# EAGLE schematic LED (EAGLE 9.5.1)
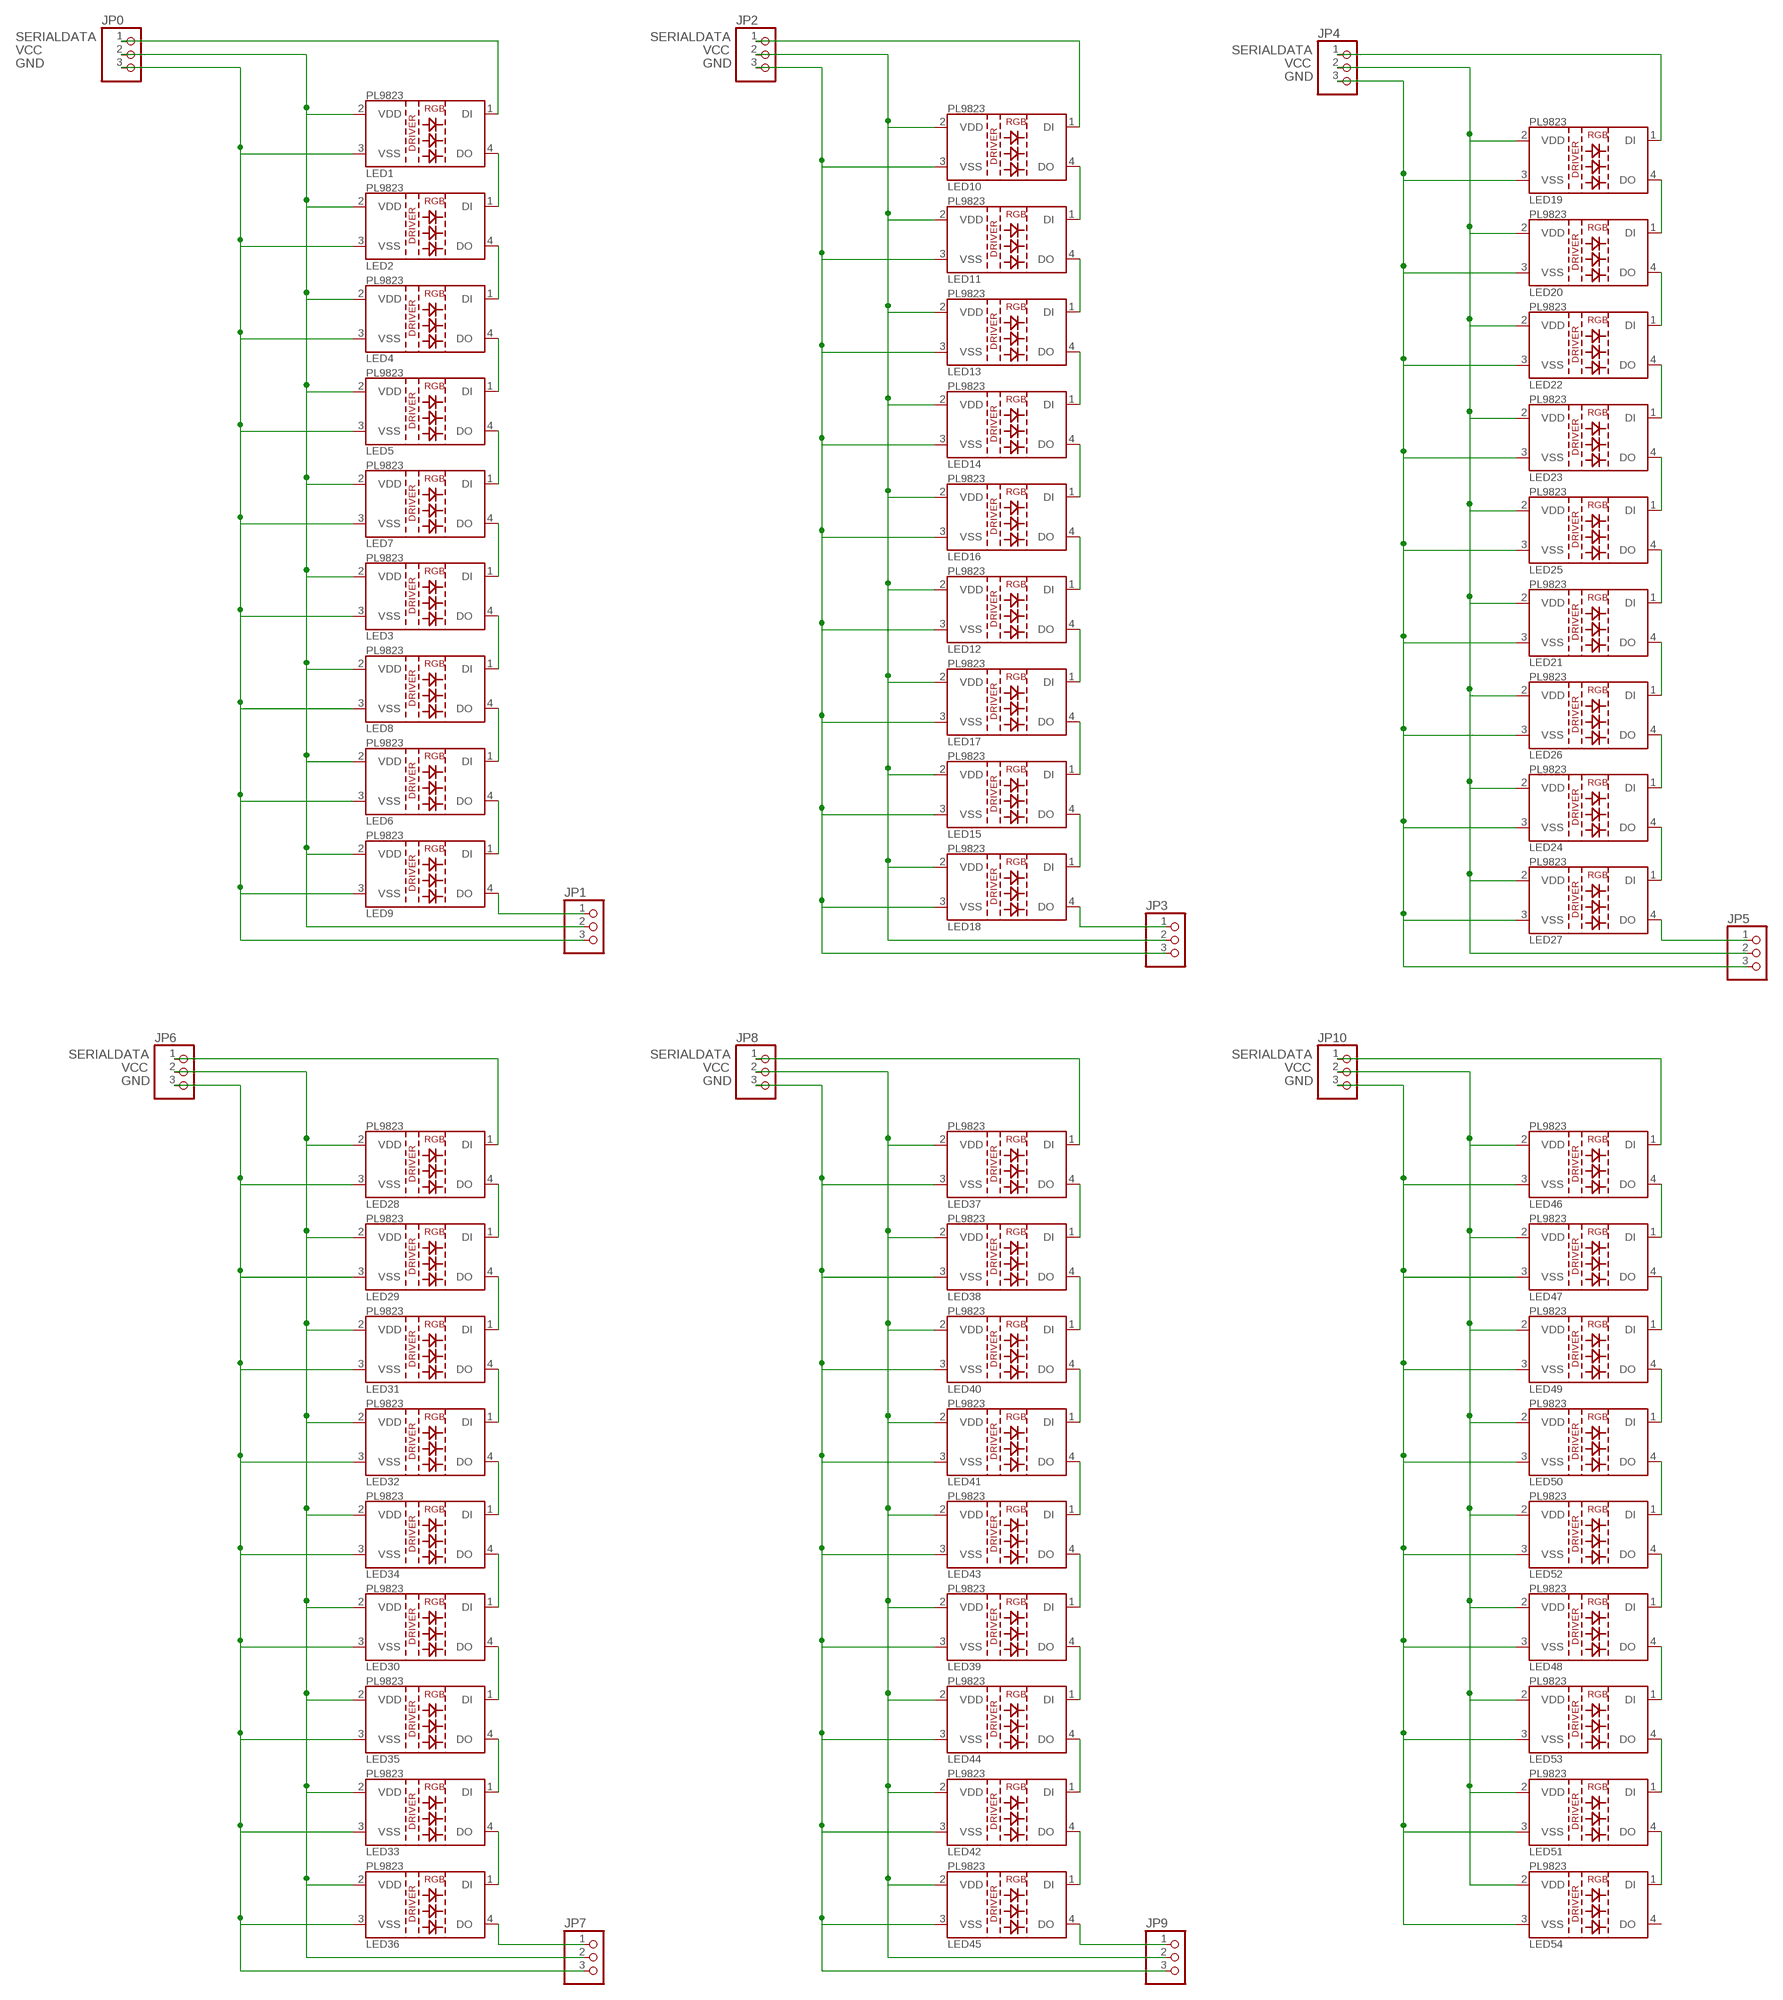
[diagram p0: schematic, sheet 1]

## Parts
JP0  PINHD-1X3  [1X03]
JP1  PINHD-1X3  [1X03]
JP2  PINHD-1X3  [1X03]
JP3  PINHD-1X3  [1X03]
JP4  PINHD-1X3  [1X03]
JP5  PINHD-1X3  [1X03]
JP6  PINHD-1X3  [1X03]
JP7  PINHD-1X3  [1X03]
JP8  PINHD-1X3  [1X03]
JP9  PINHD-1X3  [1X03]
JP10  PINHD-1X3  [1X03]
LED1  LED-PL9823-F5  [LED-PL9823-F5]
LED2  LED-PL9823-F5  [LED-PL9823-F5]
LED3  LED-PL9823-F5  [LED-PL9823-F5]
LED4  LED-PL9823-F5  [LED-PL9823-F5]
LED5  LED-PL9823-F5  [LED-PL9823-F5]
LED6  LED-PL9823-F5  [LED-PL9823-F5]
LED7  LED-PL9823-F5  [LED-PL9823-F5]
LED8  LED-PL9823-F5  [LED-PL9823-F5]
LED9  LED-PL9823-F5  [LED-PL9823-F5]
LED10  LED-PL9823-F5  [LED-PL9823-F5]
LED11  LED-PL9823-F5  [LED-PL9823-F5]
LED12  LED-PL9823-F5  [LED-PL9823-F5]
LED13  LED-PL9823-F5  [LED-PL9823-F5]
LED14  LED-PL9823-F5  [LED-PL9823-F5]
LED15  LED-PL9823-F5  [LED-PL9823-F5]
LED16  LED-PL9823-F5  [LED-PL9823-F5]
LED17  LED-PL9823-F5  [LED-PL9823-F5]
LED18  LED-PL9823-F5  [LED-PL9823-F5]
LED19  LED-PL9823-F5  [LED-PL9823-F5]
LED20  LED-PL9823-F5  [LED-PL9823-F5]
LED21  LED-PL9823-F5  [LED-PL9823-F5]
LED22  LED-PL9823-F5  [LED-PL9823-F5]
LED23  LED-PL9823-F5  [LED-PL9823-F5]
LED24  LED-PL9823-F5  [LED-PL9823-F5]
LED25  LED-PL9823-F5  [LED-PL9823-F5]
LED26  LED-PL9823-F5  [LED-PL9823-F5]
LED27  LED-PL9823-F5  [LED-PL9823-F5]
LED28  LED-PL9823-F5  [LED-PL9823-F5]
LED29  LED-PL9823-F5  [LED-PL9823-F5]
LED30  LED-PL9823-F5  [LED-PL9823-F5]
LED31  LED-PL9823-F5  [LED-PL9823-F5]
LED32  LED-PL9823-F5  [LED-PL9823-F5]
LED33  LED-PL9823-F5  [LED-PL9823-F5]
LED34  LED-PL9823-F5  [LED-PL9823-F5]
LED35  LED-PL9823-F5  [LED-PL9823-F5]
LED36  LED-PL9823-F5  [LED-PL9823-F5]
LED37  LED-PL9823-F5  [LED-PL9823-F5]
LED38  LED-PL9823-F5  [LED-PL9823-F5]
LED39  LED-PL9823-F5  [LED-PL9823-F5]
LED40  LED-PL9823-F5  [LED-PL9823-F5]
LED41  LED-PL9823-F5  [LED-PL9823-F5]
LED42  LED-PL9823-F5  [LED-PL9823-F5]
LED43  LED-PL9823-F5  [LED-PL9823-F5]
LED44  LED-PL9823-F5  [LED-PL9823-F5]
LED45  LED-PL9823-F5  [LED-PL9823-F5]
LED46  LED-PL9823-F5  [LED-PL9823-F5]
LED47  LED-PL9823-F5  [LED-PL9823-F5]
LED48  LED-PL9823-F5  [LED-PL9823-F5]
LED49  LED-PL9823-F5  [LED-PL9823-F5]
LED50  LED-PL9823-F5  [LED-PL9823-F5]
LED51  LED-PL9823-F5  [LED-PL9823-F5]
LED52  LED-PL9823-F5  [LED-PL9823-F5]
LED53  LED-PL9823-F5  [LED-PL9823-F5]
LED54  LED-PL9823-F5  [LED-PL9823-F5]

## Nets
GND: JP0.3 JP1.3 JP2.3 JP3.3 JP4.3 JP5.3 JP6.3 JP7.3 JP8.3 JP9.3 JP10.3 LED1.3(VSS) LED2.3(VSS) LED3.3(VSS) LED4.3(VSS) LED5.3(VSS) LED6.3(VSS) LED7.3(VSS) LED8.3(VSS) LED9.3(VSS) LED10.3(VSS) LED11.3(VSS) LED12.3(VSS) LED13.3(VSS) LED14.3(VSS) LED15.3(VSS) LED16.3(VSS) LED17.3(VSS) LED18.3(VSS) LED19.3(VSS) LED20.3(VSS) LED21.3(VSS) LED22.3(VSS) LED23.3(VSS) LED24.3(VSS) LED25.3(VSS) LED26.3(VSS) LED27.3(VSS) LED28.3(VSS) LED29.3(VSS) LED30.3(VSS) LED31.3(VSS) LED32.3(VSS) LED33.3(VSS) LED34.3(VSS) LED35.3(VSS) LED36.3(VSS) LED37.3(VSS) LED38.3(VSS) LED39.3(VSS) LED40.3(VSS) LED41.3(VSS) LED42.3(VSS) LED43.3(VSS) LED44.3(VSS) LED45.3(VSS) LED46.3(VSS) LED47.3(VSS) LED48.3(VSS) LED49.3(VSS) LED50.3(VSS) LED51.3(VSS) LED52.3(VSS) LED53.3(VSS) LED54.3(VSS)
N$1: LED10.4(DO) LED11.1(DI)
N$2: LED1.4(DO) LED2.1(DI)
N$3: LED2.4(DO) LED4.1(DI)
N$4: LED4.4(DO) LED5.1(DI)
N$5: LED5.4(DO) LED7.1(DI)
N$6: LED3.1(DI) LED7.4(DO)
N$7: LED3.4(DO) LED8.1(DI)
N$8: LED6.1(DI) LED8.4(DO)
N$9: LED6.4(DO) LED9.1(DI)
N$10: JP1.1 LED9.4(DO)
N$11: LED11.4(DO) LED13.1(DI)
N$12: LED13.4(DO) LED14.1(DI)
N$13: LED14.4(DO) LED16.1(DI)
N$14: LED12.1(DI) LED16.4(DO)
N$15: LED12.4(DO) LED17.1(DI)
N$16: LED15.1(DI) LED17.4(DO)
N$17: LED15.4(DO) LED18.1(DI)
N$18: JP3.1 LED18.4(DO)
N$19: LED19.4(DO) LED20.1(DI)
N$20: LED20.4(DO) LED22.1(DI)
N$21: LED22.4(DO) LED23.1(DI)
N$22: LED23.4(DO) LED25.1(DI)
N$23: LED21.1(DI) LED25.4(DO)
N$24: LED21.4(DO) LED26.1(DI)
N$25: LED24.1(DI) LED26.4(DO)
N$26: LED24.4(DO) LED27.1(DI)
N$27: JP5.1 LED27.4(DO)
N$28: LED28.4(DO) LED29.1(DI)
N$29: LED29.4(DO) LED31.1(DI)
N$30: LED31.4(DO) LED32.1(DI)
N$31: LED32.4(DO) LED34.1(DI)
N$32: LED30.1(DI) LED34.4(DO)
N$33: LED30.4(DO) LED35.1(DI)
N$34: LED33.1(DI) LED35.4(DO)
N$35: LED33.4(DO) LED36.1(DI)
N$37: LED37.4(DO) LED38.1(DI)
N$38: LED38.4(DO) LED40.1(DI)
N$39: LED40.4(DO) LED41.1(DI)
N$40: LED41.4(DO) LED43.1(DI)
N$41: LED39.1(DI) LED43.4(DO)
N$42: LED39.4(DO) LED44.1(DI)
N$43: LED42.1(DI) LED44.4(DO)
N$44: LED42.4(DO) LED45.1(DI)
N$45: JP9.1 LED45.4(DO)
N$46: LED46.4(DO) LED47.1(DI)
N$47: LED47.4(DO) LED49.1(DI)
N$48: LED49.4(DO) LED50.1(DI)
N$49: LED50.4(DO) LED52.1(DI)
N$50: LED48.1(DI) LED52.4(DO)
N$51: LED48.4(DO) LED53.1(DI)
N$52: LED51.1(DI) LED53.4(DO)
N$53: LED51.4(DO) LED54.1(DI)
SERIALDATA: JP0.1 JP2.1 JP4.1 JP6.1 JP8.1 JP10.1 LED1.1(DI) LED10.1(DI) LED19.1(DI) LED28.1(DI) LED37.1(DI) LED46.1(DI)
SERIALOUT: JP7.1 LED36.4(DO)
VCC: JP0.2 JP1.2 JP2.2 JP3.2 JP4.2 JP5.2 JP6.2 JP7.2 JP8.2 JP9.2 JP10.2 LED1.2(VDD) LED2.2(VDD) LED3.2(VDD) LED4.2(VDD) LED5.2(VDD) LED6.2(VDD) LED7.2(VDD) LED8.2(VDD) LED9.2(VDD) LED10.2(VDD) LED11.2(VDD) LED12.2(VDD) LED13.2(VDD) LED14.2(VDD) LED15.2(VDD) LED16.2(VDD) LED17.2(VDD) LED18.2(VDD) LED19.2(VDD) LED20.2(VDD) LED21.2(VDD) LED22.2(VDD) LED23.2(VDD) LED24.2(VDD) LED25.2(VDD) LED26.2(VDD) LED27.2(VDD) LED28.2(VDD) LED29.2(VDD) LED30.2(VDD) LED31.2(VDD) LED32.2(VDD) LED33.2(VDD) LED34.2(VDD) LED35.2(VDD) LED36.2(VDD) LED37.2(VDD) LED38.2(VDD) LED39.2(VDD) LED40.2(VDD) LED41.2(VDD) LED42.2(VDD) LED43.2(VDD) LED44.2(VDD) LED45.2(VDD) LED46.2(VDD) LED47.2(VDD) LED48.2(VDD) LED49.2(VDD) LED50.2(VDD) LED51.2(VDD) LED52.2(VDD) LED53.2(VDD) LED54.2(VDD)
Unconnected: LED54.4(DO)

## Library data of the parts
JP0 JP1-JP10 = pinhead:PINHD-1X3: PIN HEADER
LED1-LED54 = Ai_LED:LED-PL9823